# Altium schematic sheet LEDs.SchDoc: LEDs
size A3; DocumentNumber: 2; SheetNumber: 2; SheetTotal: 3
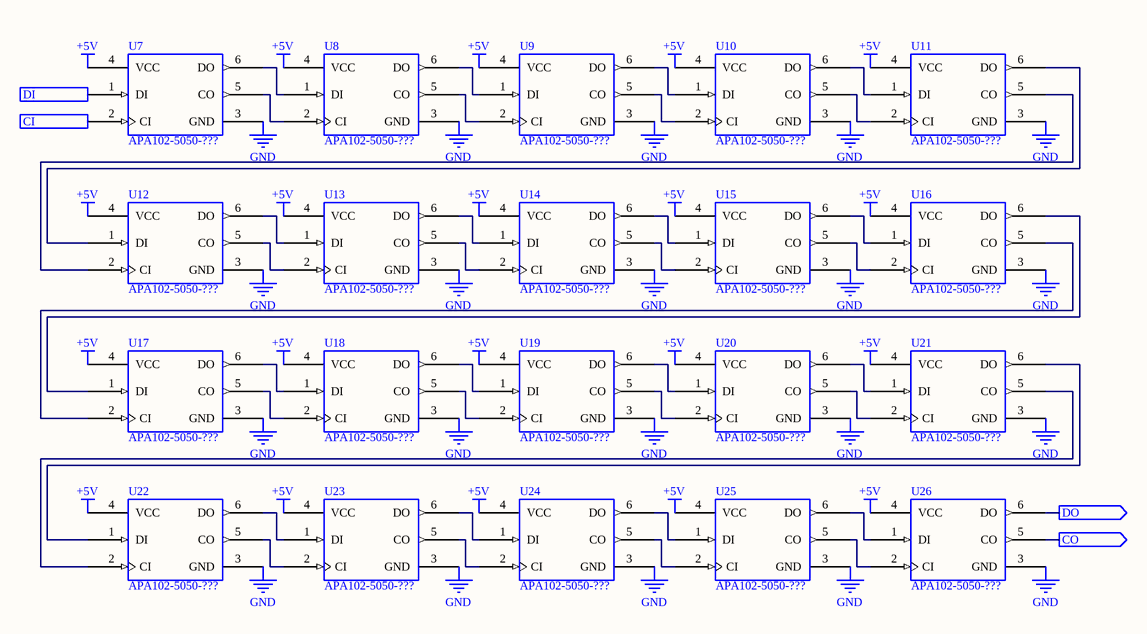
[diagram p0: LEDs.SchDoc]

## Parts
U7  APA102-5050-???  [C2100EF9-5A1B-4012-AEAB-289AE8E97B6B]
U8  APA102-5050-???  [C2100EF9-5A1B-4012-AEAB-289AE8E97B6B]
U9  APA102-5050-???  [C2100EF9-5A1B-4012-AEAB-289AE8E97B6B]
U10  APA102-5050-???  [C2100EF9-5A1B-4012-AEAB-289AE8E97B6B]
U11  APA102-5050-???  [C2100EF9-5A1B-4012-AEAB-289AE8E97B6B]
U12  APA102-5050-???  [C2100EF9-5A1B-4012-AEAB-289AE8E97B6B]
U13  APA102-5050-???  [C2100EF9-5A1B-4012-AEAB-289AE8E97B6B]
U14  APA102-5050-???  [C2100EF9-5A1B-4012-AEAB-289AE8E97B6B]
U15  APA102-5050-???  [C2100EF9-5A1B-4012-AEAB-289AE8E97B6B]
U16  APA102-5050-???  [C2100EF9-5A1B-4012-AEAB-289AE8E97B6B]
U17  APA102-5050-???  [C2100EF9-5A1B-4012-AEAB-289AE8E97B6B]
U18  APA102-5050-???  [C2100EF9-5A1B-4012-AEAB-289AE8E97B6B]
U19  APA102-5050-???  [C2100EF9-5A1B-4012-AEAB-289AE8E97B6B]
U20  APA102-5050-???  [C2100EF9-5A1B-4012-AEAB-289AE8E97B6B]
U21  APA102-5050-???  [C2100EF9-5A1B-4012-AEAB-289AE8E97B6B]
U22  APA102-5050-???  [C2100EF9-5A1B-4012-AEAB-289AE8E97B6B]
U23  APA102-5050-???  [C2100EF9-5A1B-4012-AEAB-289AE8E97B6B]
U24  APA102-5050-???  [C2100EF9-5A1B-4012-AEAB-289AE8E97B6B]
U25  APA102-5050-???  [C2100EF9-5A1B-4012-AEAB-289AE8E97B6B]
U26  APA102-5050-???  [C2100EF9-5A1B-4012-AEAB-289AE8E97B6B]

## Ports
CI (in), CO (out), DI (in), DO (out)

## Nets
+5V: U7.4(VCC) U8.4(VCC) U9.4(VCC) U10.4(VCC) U11.4(VCC) U12.4(VCC) U13.4(VCC) U14.4(VCC) U15.4(VCC) U16.4(VCC) U17.4(VCC) U18.4(VCC) U19.4(VCC) U20.4(VCC) U21.4(VCC) U22.4(VCC) U23.4(VCC) U24.4(VCC) U25.4(VCC) U26.4(VCC)
GND: U7.3(GND) U8.3(GND) U9.3(GND) U10.3(GND) U11.3(GND) U12.3(GND) U13.3(GND) U14.3(GND) U15.3(GND) U16.3(GND) U17.3(GND) U18.3(GND) U19.3(GND) U20.3(GND) U21.3(GND) U22.3(GND) U23.3(GND) U24.3(GND) U25.3(GND) U26.3(GND)
CI: U7.2(CI) ; port CI
CO: U26.5(CO) ; port CO
DI: U7.1(DI) ; port DI
DO: U26.6(DO) ; port DO
NetU7_5: U7.5(CO) U8.2(CI)
NetU7_6: U7.6(DO) U8.1(DI)
NetU8_5: U8.5(CO) U9.2(CI)
NetU8_6: U8.6(DO) U9.1(DI)
NetU9_5: U9.5(CO) U10.2(CI)
NetU9_6: U9.6(DO) U10.1(DI)
NetU10_5: U10.5(CO) U11.2(CI)
NetU10_6: U10.6(DO) U11.1(DI)
NetU11_5: U11.5(CO) U12.2(CI)
NetU11_6: U11.6(DO) U12.1(DI)
NetU12_5: U12.5(CO) U13.2(CI)
NetU12_6: U12.6(DO) U13.1(DI)
NetU13_5: U13.5(CO) U14.2(CI)
NetU13_6: U13.6(DO) U14.1(DI)
NetU14_5: U14.5(CO) U15.2(CI)
NetU14_6: U14.6(DO) U15.1(DI)
NetU15_5: U15.5(CO) U16.2(CI)
NetU15_6: U15.6(DO) U16.1(DI)
NetU16_5: U16.5(CO) U17.2(CI)
NetU16_6: U16.6(DO) U17.1(DI)
NetU17_5: U17.5(CO) U18.2(CI)
NetU17_6: U17.6(DO) U18.1(DI)
NetU18_5: U18.5(CO) U19.2(CI)
NetU18_6: U18.6(DO) U19.1(DI)
NetU19_5: U19.5(CO) U20.2(CI)
NetU19_6: U19.6(DO) U20.1(DI)
NetU20_5: U20.5(CO) U21.2(CI)
NetU20_6: U20.6(DO) U21.1(DI)
NetU21_5: U21.5(CO) U22.2(CI)
NetU21_6: U21.6(DO) U22.1(DI)
NetU22_5: U22.5(CO) U23.2(CI)
NetU22_6: U22.6(DO) U23.1(DI)
NetU23_5: U23.5(CO) U24.2(CI)
NetU23_6: U23.6(DO) U24.1(DI)
NetU24_5: U24.5(CO) U25.2(CI)
NetU24_6: U24.6(DO) U25.1(DI)
NetU25_5: U25.5(CO) U26.2(CI)
NetU25_6: U25.6(DO) U26.1(DI)

## Notes on the sheet
- Title
- Fermium LABS srl
- Size:
- Date:
- File:
- A4
- Prj
- Time:
- Sheet
- of
- Via Monselice 15a
- 35142 Padova PD
- Italy
- Git Hash:

## Library data of the parts
U7-U26 = fe772892-1231-440c-ad15-efcb7032d7d7: IC SMD LED RGB DIGITAL APA102C-5050; Manufacturer 1: APA ELECTRONIC; id: 14812; Sourcing Notes: Attention! Only source from APA ELECTRONIC CO.LTD. through the provided email address. NO RESELLERS!!!; Part Number: fe772892-1231-440c-ad15-efcb7032d7d7; Manufacturer Part Number 1: APA102-5050-???